# EasyEDA Pro project myfly.eprj

# Schematic Schematic1

## Sheets
1 P1: Board Name: Board1; Create Date: 2025-08-05; Page Name: P1; Project Name: myfly; Schematic Name: Schematic1; Update Date: 2025-09-26; Company: 嘉立创EDA; Page Size: A4; Version: V1.0
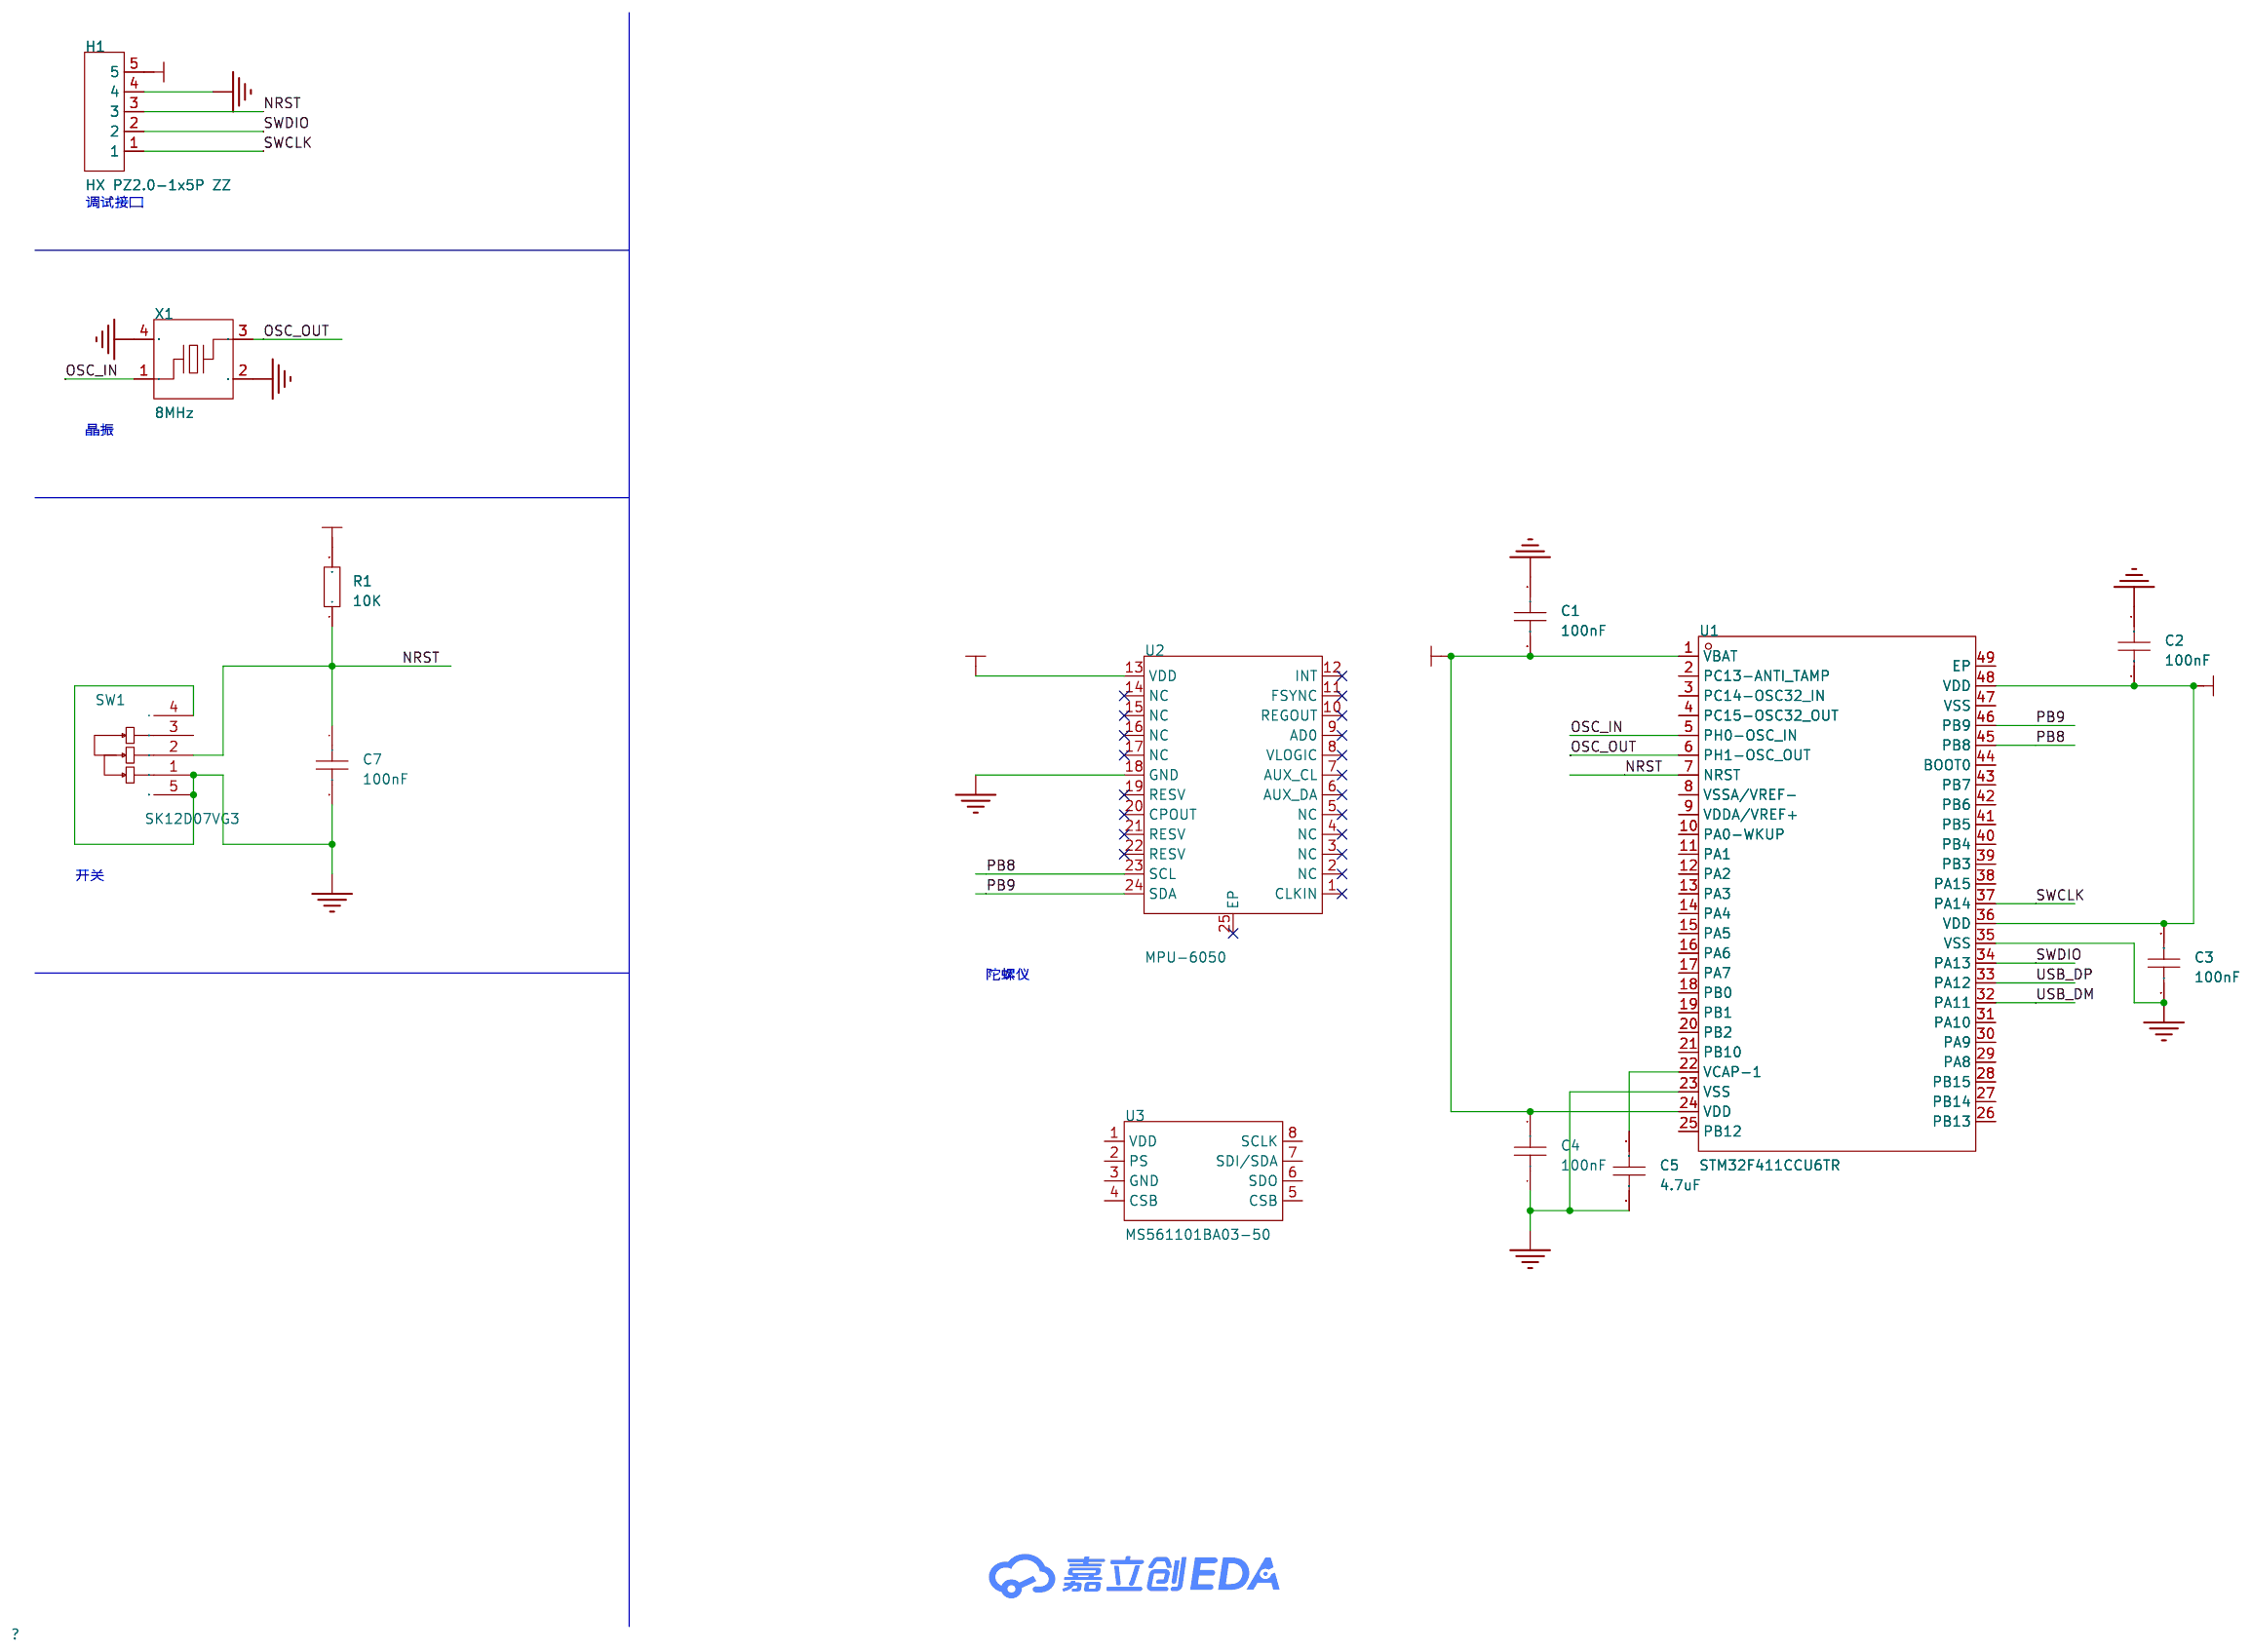
[diagram p0: P1]
2 P2: Create Date: 2025-09-27; Page Name: P2; Update Date: 2025-09-27
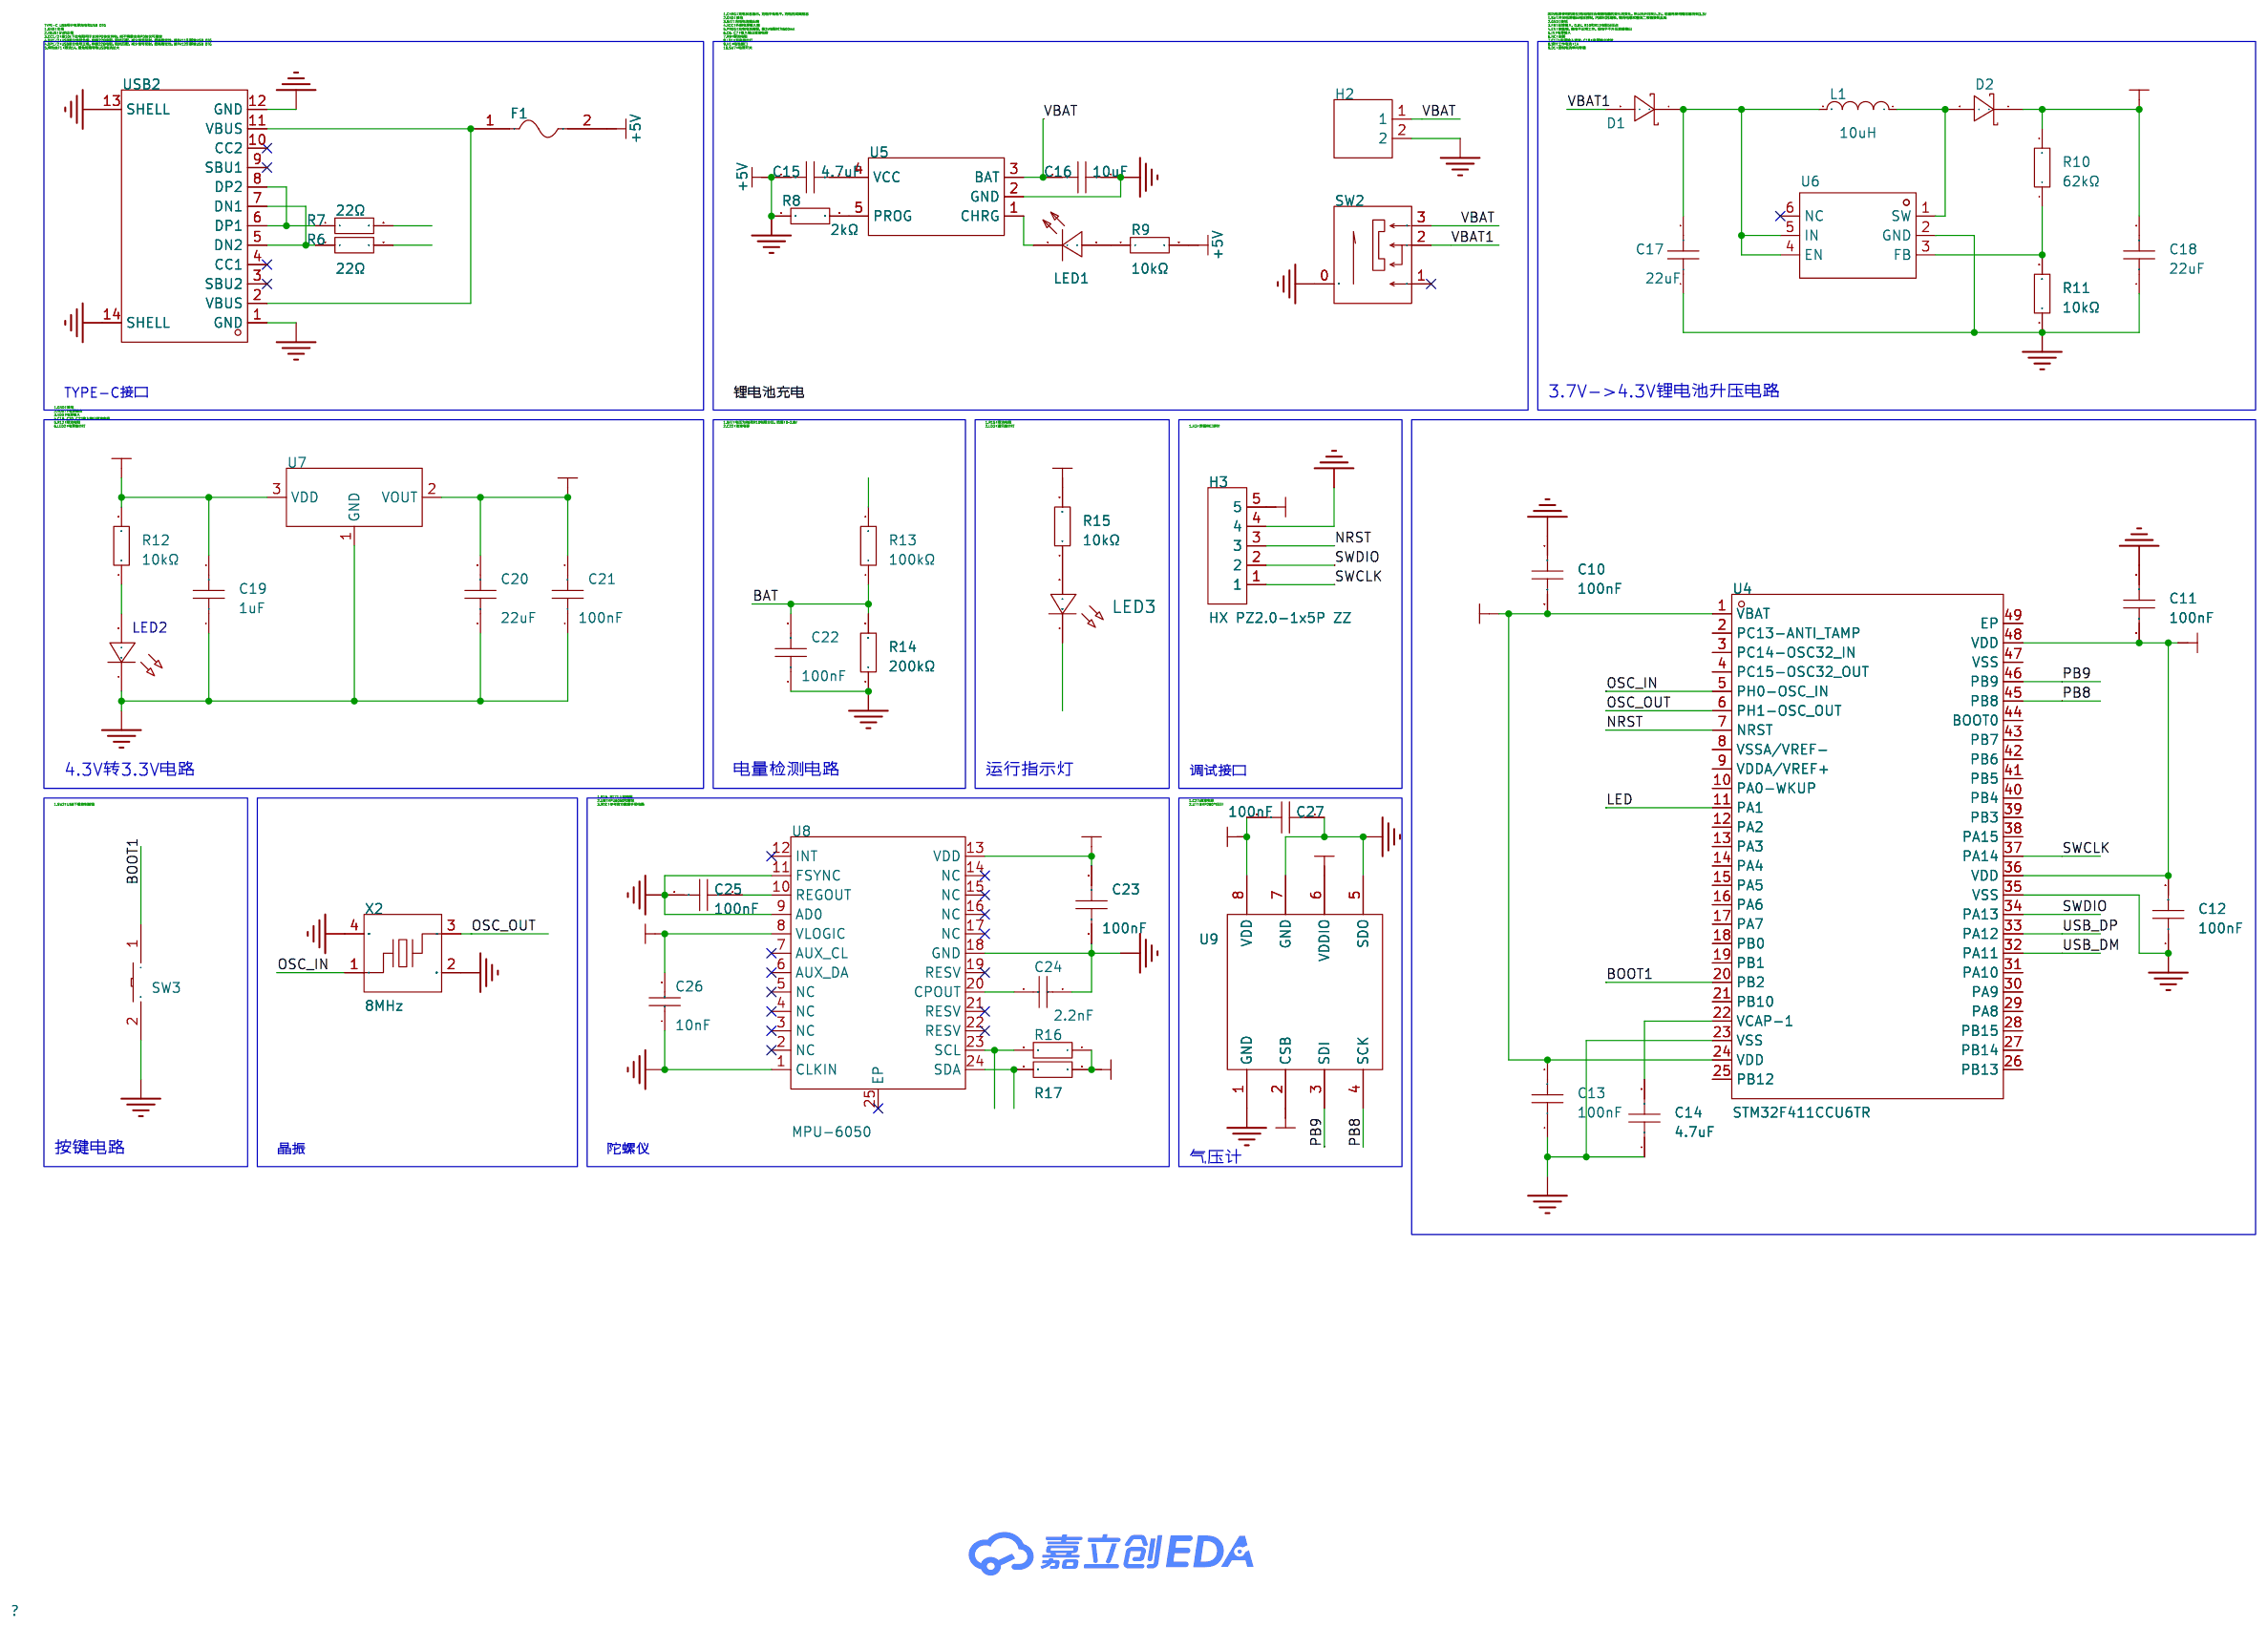
[diagram p1: P2]

## Parts
sheet P1
C1  100nF  [C0402]
C2  100nF  [C0402]
C3  100nF  [C0402]
C4  100nF  [C0402]
C5  4.7uF  [C0402]
C7  100nF  [C0402]
H1  HX PZ2.0-1x5P ZZ  [HDR-TH_5P-P2.00-V-M]
R1  10K  [R0402]
SW1  SK12D07VG3  [SW-TH_SK12D07VG3]
U1  STM32F411CCU6TR  [QFN-48_L7.0-W7.0-P0.50-BL-EP5.1]
U2  MPU-6050  [QFN-24_L4.0-W4.0-P0.50-BL-EP2.7]
U3  MS561101BA03-50  [SENSORS-SMD_MS5611-01BA03]
X1  8MHz  [CRYSTAL-SMD_4P-L3.2-W2.5-BL]
sheet P2
C10  100nF  [C0402]
C11  100nF  [C0402]
C12  100nF  [C0402]
C13  100nF  [C0402]
C14  4.7uF  [C0402]
C15  4.7uF  [C0603]
C16  10uF  [C0603]
C17  22uF  [C0805]
C18  22uF  [C0805]
C19  1uF  [C0603]
C20  22uF  [C0603]
C21  100nF  [C0603]
C22  100nF  [C0603]
C23  100nF  [C0603]
C24  2.2nF  [C0603]
C25  100nF  [C0603]
C26  10nF  [C0603]
C27  100nF  [C0603]
D1  1N5819WS  [SOD-323_L1.8-W1.3-LS2.5-RD]
D2  1N5819WS  [SOD-323_L1.8-W1.3-LS2.5-RD]
F1  JK-nSMD100/16V  [F1206]
H2  B-2100S02P-A110  [HDR-TH_2P-P2.54-V-M-1]
H3  HX PZ2.0-1x5P ZZ  [HDR-TH_5P-P2.00-V-M]
L1  10uH  [IND-SMD_L2.5-W2.0]
LED1  KT-0603R  [LED0603-RD]
LED2  -  [LED_0603]
LED3  -  [LED_0603]
R6  22Ω  [R0603]
R7  22Ω  [R0603]
R8  2kΩ  [R0603]
R9  10kΩ  [R0603]
R10  62kΩ  [R0603]
R11  10kΩ  [R0603]
R12  10kΩ  [R0603]
R13  100kΩ  [R0603]
R14  200kΩ  [R0603]
R15  10kΩ  [R0603]
R16  4.7kΩ  [R0603]
R17  4.7kΩ  [R0603]
SW2  SK-3296S-01-L1  [SW-SMD_3P-P1.50_L2.7-W6.6]
SW3  TS-1101-C-W  [SW-SMD_L6.0-W3.3-LS8.0]
U4  STM32F411CCU6TR  [QFN-48_L7.0-W7.0-P0.50-BL-EP5.1]
U5  LTH7  [SOT-23-5_L2.9-W1.6-P0.95-LS2.8-BR]
U6  MT3608  [SOT-23-6_L2.9-W1.6-P0.95-LS2.8-BL]
U7  662K  [SOT-23-3_L2.9-W1.3-P1.90-LS2.4-BR]
U8  MPU-6050  [QFN-24_L4.0-W4.0-P0.50-BL-EP2.7]
U9  BMP280  [LGA-8_L2.5-W2.0-P0.65_AMP6127]
USB2  TYPE-C 16PIN 2MD(073)  [USB-C-SMD_TYPE-C-6PIN-2MD-073]
X2  8MHz  [CRYSTAL-SMD_4P-L3.2-W2.5-BL]

## Library data of the parts
C1-C4 C7 C10-C13 = CGA0402X7R104J250GT: LCSC Part Name: 100nF ±5% 25V; Supplier Part: C22435941; Manufacturer: HRE(芯声); Supplier Footprint: 0402; JLCPCB Part Class: 扩展库; Datasheet: https://atta.szlcsc.com/upload/public/pdf/source/20240523/30A76BBCEDA9B9BDA9820C36AA3915E8.pdf; Supplier: LCSC; Tolerance: ±5%; Voltage Rating: 25V; Temperature Coefficient: X7R
C5 C14 = HGC0402R5475K6R3NTEJ: LCSC Part Name: 4.7uF ±10% 6.3V; Supplier Part: C33595852; Manufacturer: Chinocera(华瓷); Supplier Footprint: 0402; JLCPCB Part Class: 扩展库; Datasheet: https://atta.szlcsc.com/upload/public/pdf/source/20240724/7749F3690BCC21BF5565A9D339ADF00C.pdf; Supplier: LCSC; Tolerance: ±10%; Voltage Rating: 6.3V; Temperature Coefficient: X5R
H1 H3 = HX PZ2.0-1x5P ZZ: LCSC Part Name: 1x5P 间距:2mm 方针 直插; Supplier Part: C22438288; Manufacturer: hanxia(韩下); Supplier Footprint: 插件,P=2mm; JLCPCB Part Class: 扩展库; Datasheet: https://atta.szlcsc.com/upload/public/pdf/source/20240522/F56687081F4A85741F3B635386D52F83.pdf; Supplier: LCSC; Pin Structure: 1x5P; Pitch: 2mm; Circluar Pins/Square Pins: 方针; Mounting Type: 直插; Number of Rows: 单排; Number of Pins: 5P; Current Rating: 1.5A; Length of Mating Pin: 3.9mm; Insulation Height: 2mm; Length of End Connection Pin: 2.8mm; Contact Material: 磷青铜; Contact Plating: 金; Operating Temperature: -40℃~+105℃; Color: 黑色
R1 = Res_0402: Supplier Footprint: 0402
SW1 = SK12D07VG3: LCSC Part Name: 两档位卧式拨动开关,柄长3MM; Supplier Part: C431547; Manufacturer: SHOU HAN(首韩); Supplier Footprint: 插件,8.7x4.4mm; JLCPCB Part Class: 扩展库; Datasheet: https://item.szlcsc.com/datasheet/SK12D07VG3/427904.html; Supplier: LCSC; Circuit: 单刀双掷; Termination Style: PC引脚; Length: 8.7mm; Width: 4.4mm; Switch Height: 4.7mm; Current Rating: 500mA; Voltage Rating: 50V; Life: 5千次; Operating Temperature: -10℃~+50℃
U1 U4 = STM32F411CCU6TR: LCSC Part Name: 带DSP和FPU的高性能基本型系列ARM Cortex-M4 MCU，具有256 KB Flash、100 MHz CPU和ART加速器; Supplier Part: C190642; Manufacturer: ST(意法半导体); Supplier Footprint: UFQFPN-48(7x7); JLCPCB Part Class: 扩展库; Datasheet: https://atta.szlcsc.com/upload/public/pdf/source/20190409/C382005_8CBD24B6066A9CB66A02776CA579708B.pdf; Supplier: LCSC; CPU Core: ARM-M4; CPU Maximum Speed: 100MHz; Program Storage Size: 256KB; Program Memory Type: FLASH; Number of I/O: 36; ADC (Bit): 12bit; Voltage - Supply: 1.7V~3.6V
U2 U8 = MPU-6050: Supplier Part: C24112; Manufacturer: TDK InvenSense(应美盛); Supplier Footprint: QFN-24-EP(4x4); JLCPCB Part Class: 扩展库; Datasheet: https://item.szlcsc.com/datasheet/MPU-6050/24852.html; Supplier: LCSC; Sensor Type: 加速度计陀螺仪; Operating Temperature: -40℃~+85℃
U3 = MS561101BA03-50: Supplier Part: C15639; Manufacturer: TE Connectivity(泰科电子); Supplier Footprint: QFN-8(3x5); JLCPCB Part Class: 扩展库; Datasheet: https://item.szlcsc.com/datasheet/MS561101BA03-50/16320.html; Supplier: LCSC; Pressure range: 1Kpa~1.2bar; Voltage - Supply: 1.8V~3.6V; Standby Current: 140nA; Interface: SpI；I2C; Operating Temperature: -40℃~+85℃; Response time: 8.22ms
X1 X2 = SX3B8.000F2010F30: LCSC Part Name: 8MHz ±10ppm 20pF; Supplier Part: C2901646; Manufacturer: SCTF(星通时频); Supplier Footprint: SMD3225-4P; JLCPCB Part Class: 扩展库; Datasheet: https://item.szlcsc.com/datasheet/SX3B8.000F2010F30/3151459.html; Supplier: LCSC; Type: 贴片晶振; Normal temperature Frequency Tolerance: ±10ppm; Load Capacitance: 20pF; Frequency Stability: ±30ppm; Equivalent Series Resistance(ESR): 300Ω; Operating Temperature: -40℃~+85℃
C15 = CL10A475KO8NNNC: LCSC Part Name: 4.7uF ±10% 16V; Supplier Part: C19666; Manufacturer: SAMSUNG(三星); Supplier Footprint: 0603; JLCPCB Part Class: 基础库; Datasheet: https://item.szlcsc.com/datasheet/CL10A475KO8NNNC/20375.html; Supplier: LCSC; Tolerance: ±10%; Voltage Rating: 16V; Temperature Coefficient: X5R
C16 = CL10A106KP8NNNC: LCSC Part Name: 10uF ±10% 10V; Supplier Part: C19702; Manufacturer: SAMSUNG(三星); Supplier Footprint: 0603; JLCPCB Part Class: 基础库; Datasheet: https://item.szlcsc.com/datasheet/CL10A106KP8NNNC/20411.html; Supplier: LCSC; Tolerance: ±10%; Voltage Rating: 10V; Temperature Coefficient: X5R
C17 C18 = CL21A226MAQNNNE: LCSC Part Name: 22uF ±20% 25V; Supplier Part: C45783; Manufacturer: SAMSUNG(三星); Supplier Footprint: 0805; JLCPCB Part Class: 基础库; Datasheet: https://item.szlcsc.com/datasheet/CL21A226MAQNNNE/46786.html; Supplier: LCSC; Tolerance: ±20%; Voltage Rating: 25V; Temperature Coefficient: X5R
C19 = CL10A105KB8NNNC: LCSC Part Name: 1uF ±10% 50V; Supplier Part: C15849; Manufacturer: SAMSUNG(三星); Supplier Footprint: 0603; JLCPCB Part Class: 基础库; Datasheet: https://item.szlcsc.com/datasheet/CL10A105KB8NNNC/16531.html; Supplier: LCSC; Tolerance: ±10%; Voltage Rating: 50V; Temperature Coefficient: X5R
C20 = CL10A226MQ8NRNC: LCSC Part Name: 22uF ±20% 6.3V; Supplier Part: C59461; Manufacturer: SAMSUNG(三星); Supplier Footprint: 0603; JLCPCB Part Class: 基础库; Datasheet: https://item.szlcsc.com/datasheet/CL10A226MQ8NRNC/60514.html; Supplier: LCSC; Tolerance: ±20%; Voltage Rating: 6.3V; Temperature Coefficient: X5R
C21-C23 C25 C27 = CL10B104KB8NNNC: LCSC Part Name: 100nF ±10% 50V; Supplier Part: C1591; Manufacturer: SAMSUNG(三星); Supplier Footprint: 0603; JLCPCB Part Class: 扩展库; Datasheet: https://item.szlcsc.com/datasheet/CL10B104KB8NNNC/1943.html; Supplier: LCSC; Tolerance: ±10%; Voltage Rating: 50V; Temperature Coefficient: X7R
C24 = CL10B222KB8NNNC: LCSC Part Name: 2.2nF ±10% 50V; Supplier Part: C16033; Manufacturer: SAMSUNG(三星); Supplier Footprint: 0603; JLCPCB Part Class: 扩展库; Datasheet: https://item.szlcsc.com/datasheet/CL10B222KB8NNNC/16715.html; Supplier: LCSC; Tolerance: ±10%; Voltage Rating: 50V; Temperature Coefficient: X7R
C26 = CL10B103KB8NNNC: LCSC Part Name: 10nF ±10% 50V; Supplier Part: C1589; Manufacturer: SAMSUNG(三星); Supplier Footprint: 0603; JLCPCB Part Class: 扩展库; Datasheet: https://item.szlcsc.com/datasheet/CL10B103KB8NNNC/1941.html; Supplier: LCSC; Tolerance: ±10%; Voltage Rating: 50V; Temperature Coefficient: X7R
D1 D2 = 1N5819WS_C191023: LCSC Part Name: 电压:40V 电流:1A; Supplier Part: C191023; Manufacturer: Hottech(合科泰); Supplier Footprint: SOD-323; JLCPCB Part Class: 基础库; Datasheet: https://item.szlcsc.com/datasheet/1N5819WS/213850.html; Supplier: LCSC; Voltage - Forward(Vf@If): 600mV@1A; Voltage - DC Reverse(Vr): 40V; Current - Rectified: 1A; Non-Repetitive Peak Forward Surge Current: 25A
F1 = JK-nSMD100/16V: LCSC Part Name: 16V 1A 1206自恢复; Supplier Part: C2830246; Manufacturer: JK(金科); Supplier Footprint: 1206; JLCPCB Part Class: 扩展库; Datasheet: https://atta.szlcsc.com/upload/public/pdf/source/20190807/C409806_27B0F7EFFA3D5CEE60CCD1EE0A933E0A.pdf; Supplier: LCSC; Voltage - Max: 16V; Current - Max: 100A; Hold Current: 1A; Trip Current: 1.8A; Resistance - Initial (Ri) (Min): 55mΩ; Resistance - Post Trip (R1) (Max): 330mΩ; Time to Trip(Max): 300ms; Operating Temperature: -40℃~+85℃
H2 = B-2100S02P-A110: LCSC Part Name: 1x2P 间距:2.54mm 直插; Supplier Part: C124375; Manufacturer: Ckmtw(灿科盟); Supplier Footprint: 插件,P=2.54mm; JLCPCB Part Class: 扩展库; Datasheet: https://item.szlcsc.com/datasheet/B-2100S02P-A110/125650.html; Supplier: LCSC; Pin Structure: 1x2P; Pitch: 2.54mm; Mounting Type: 直插; Number of Rows: 单排; Number of Pins: 2P; Length of Mating Pin: 6mm; Insulation Height: 2.54mm; Length of End Connection Pin: 3mm; Contact Material: 黄铜; Operating Temperature: -40℃~+105℃; Color: 黑色
L1 = FTC252012S100MBCA: LCSC Part Name: 10uH ±20% 1.6A; Supplier Part: C5832376; Manufacturer: cjiang(长江微电); Supplier Footprint: SMD,2x2.5mm; JLCPCB Part Class: 扩展库; Datasheet: https://atta.szlcsc.com/upload/public/pdf/source/20230602/8FFEDA9C0247A92A0D4B67554BFE4091.pdf; Supplier: LCSC; Tolerance: ±20%; Rated Current: 1.2A; Saturation Current (Isat): 1.6A; DC Resistance (DCR): 330mΩ; Type: 一体成型电感
LED1 = KT-0603R: LCSC Part Name: 0603 红灯 高亮; Supplier Part: C2286; Manufacturer: KENTO; Supplier Footprint: 0603; JLCPCB Part Class: 基础库; Datasheet: https://atta.szlcsc.com/upload/public/pdf/source/20160616/1466072038404.pdf; Supplier: LCSC; Emitted Color: 红色; Operating Temperature: -40℃~+85℃
LED2 = LED_0603-G: Supplier Footprint: 0603
LED3 = LED_0603-R: Supplier Footprint: 0603
R6 R7 = 0603WAF220JT5E: LCSC Part Name: 22Ω ±1% 100mW 厚膜电阻; Supplier Part: C23345; Manufacturer: UNI-ROYAL(厚声); Supplier Footprint: 0603; JLCPCB Part Class: 基础库; Datasheet: https://atta.szlcsc.com/upload/public/pdf/source/20200306/C422600_1E6D84923E4A46A82E41ADD87F860B5C.pdf; Supplier: LCSC; Type: 厚膜电阻; Tolerance: ±1%; Power(Watts): 100mW; Overload Voltage (Max): 75V; Temperature Coefficient: ±100ppm/℃; Operating Temperature Range: -55℃~+155℃
R8 = 0603WAF2001T5E: LCSC Part Name: 2kΩ ±1% 100mW 厚膜电阻; Supplier Part: C22975; Manufacturer: UNI-ROYAL(厚声); Supplier Footprint: 0603; JLCPCB Part Class: 基础库; Datasheet: https://item.szlcsc.com/datasheet/0603WAF2001T5E/23702.html; Supplier: LCSC; Type: 厚膜电阻; Tolerance: ±1%; Power(Watts): 100mW; Voltage-Supply(Max): 75V; Temperature Coefficient: ±100ppm/℃; Operating Temperature: -55℃~+155℃
R9 R11 R12 R15 = 0603WAF1002T5E: LCSC Part Name: 厚膜电阻 10kΩ ±1% 100mW; Supplier Part: C25804; Manufacturer: UNI-ROYAL(厚声); Supplier Footprint: 0603; JLCPCB Part Class: 基础库; Datasheet: https://item.szlcsc.com/datasheet/0603WAF1002T5E/26547.html; Supplier: LCSC; Type: 厚膜电阻; Tolerance: ±1%; Power(Watts): 100mW; Voltage-Supply(Max): 75V; Temperature Coefficient: ±100ppm/℃; Operating Temperature: -55℃~+155℃
R10 = 0603WAF6202T5E: LCSC Part Name: 62kΩ ±1% 100mW 厚膜电阻; Supplier Part: C23221; Manufacturer: UNI-ROYAL(厚声); Supplier Footprint: 0603; JLCPCB Part Class: 扩展库; Datasheet: https://item.szlcsc.com/datasheet/0603WAF6202T5E/23948.html; Supplier: LCSC; Type: 厚膜电阻; Tolerance: ±1%; Power(Watts): 100mW; Voltage-Supply(Max): 75V; Temperature Coefficient: ±100ppm/℃; Operating Temperature: -55℃~+155℃
R13 = 0603WAF1003T5E: LCSC Part Name: 100kΩ ±1% 100mW 厚膜电阻; Supplier Part: C25803; Manufacturer: UNI-ROYAL(厚声); Supplier Footprint: 0603; JLCPCB Part Class: 基础库; Datasheet: https://item.szlcsc.com/datasheet/0603WAF1003T5E/26546.html; Supplier: LCSC; Type: 厚膜电阻; Tolerance: ±1%; Power(Watts): 100mW; Voltage-Supply(Max): 75V; Temperature Coefficient: ±100ppm/℃; Operating Temperature: -55℃~+155℃
R14 = 0603WAF2003T5E: LCSC Part Name: 200kΩ ±1% 100mW 厚膜电阻; Supplier Part: C25811; Manufacturer: UNI-ROYAL(厚声); Supplier Footprint: 0603; JLCPCB Part Class: 基础库; Datasheet: https://atta.szlcsc.com/upload/public/pdf/source/20200306/C422600_1E6D84923E4A46A82E41ADD87F860B5C.pdf; Supplier: LCSC; Type: 厚膜电阻; Tolerance: ±1%; Power(Watts): 100mW; Overload Voltage (Max): 75V; Temperature Coefficient: ±100ppm/℃; Operating Temperature Range: -55℃~+155℃
R16 R17 = 0603WAF4701T5E: LCSC Part Name: 4.7kΩ ±1% 100mW 厚膜电阻; Supplier Part: C23162; Manufacturer: UNI-ROYAL(厚声); Supplier Footprint: 0603; JLCPCB Part Class: 基础库; Datasheet: https://item.szlcsc.com/datasheet/0603WAF4701T5E/23889.html; Supplier: LCSC; Type: 厚膜电阻; Tolerance: ±1%; Power(Watts): 100mW; Voltage-Supply(Max): 75V; Temperature Coefficient: ±100ppm/℃; Operating Temperature: -55℃~+155℃
SW2 = SK-3296S-01-L1: LCSC Part Name: 柄长1.5mm 卧贴双档 滑动开关; Supplier Part: C319020; Manufacturer: XKB Connection(中国星坤); Supplier Footprint: SMD,7.8x2.8mm; JLCPCB Part Class: 扩展库; Datasheet: https://item.szlcsc.com/datasheet/SK-3296S-01-L1/300112.html; Supplier: LCSC; Circuit: 单刀双掷; Actuator Style: 矩形柱状; Termination Style: SMD接片; Length: 7.8mm; Width: 2.75mm; Switch Height: 1.35mm; Mounting Type: 卧贴; Actuator Color: 黑色; Current Rating: 50mA; Voltage Rating: 12V; Life: 1万次; Operating Temperature: -40℃~+85℃
SW3 = TS-1101-C-W: LCSC Part Name: 6*3.6*2.5mm 立贴 轻触开关; Supplier Part: C318938; Manufacturer: XKB Connectivity(中国星坤); Supplier Footprint: SMD; JLCPCB Part Class: 扩展库; Datasheet: https://atta.szlcsc.com/upload/public/pdf/source/20200227/C318938_C2E53B1EEDE37D980A33616AC086DE53.pdf; Supplier: LCSC; Circuit: 单刀单掷; Actuator Style: 矩形按钮; Operating Force: 260gf; Mounting Style: 立贴; Switch Length: 6mm; Switch Width: 3.6mm; Switch Height: 2.5mm; Strike Gundam: 不带; Contact Current: 50mA; Voltage Rating (DC): 12V; Actuator/Cap Color: 白色带淡绿; With Lamp: 无; Mechanical Life: 5万次; Operating Temperature: -30℃~+85℃
U5 = LTH7_C5342381: LCSC Part Name: 微型线性电池管理芯片; Supplier Part: C5342381; Manufacturer: TECH PUBLIC(台舟); Supplier Footprint: SOT-23-5L; JLCPCB Part Class: 扩展库; Datasheet: https://item.szlcsc.com/datasheet/LTH7/6117948.html; Supplier: LCSC
U6 = MT3608: LCSC Part Name: 老版本 高效1.2MHz 2A升压转换器; Supplier Part: C84817; Manufacturer: 西安航天民芯; Supplier Footprint: SOT-23-6; JLCPCB Part Class: 扩展库; Datasheet: https://item.szlcsc.com/datasheet/MT3608/85988.html; Supplier: LCSC; Function: 升压型; Output Type: 可调; Voltage - Supply: 2V~24V; Output Current: 2A; Frequency - Switching: 1.2MHz; Operating Temperature: -40℃~+85℃; Synchronous Rectifier: 否; Number of Outputs: 1; Topology: 升压式; Quiescent Current: 100uA；1.6mA; Switch tube (built-in/external): 内置
U7 = 662K: LCSC Part Name: 662K. 输入8V 300mA; Supplier Part: C7470756; Manufacturer: HXY MOSFET(华轩阳电子); Supplier Footprint: SOT-23; JLCPCB Part Class: 扩展库; Datasheet: https://item.szlcsc.com/datasheet/662K/8523266.html; Supplier: LCSC; Output Type: 固定; Voltage - Supply: 8V; Output Voltage: 3.3V; Output Current: 300mA; Power Supply Rejection Ratio (PSRR): 40dB@(1kHz); Voltage Dropout: 160mV@(50mA); standby current: 3uA; Features: 过流保护; Operating Temperature: -40℃~+85℃; Output Configuration: 正极; Number of Outputs: 1
U9 = BMP280: LCSC Part Name: BMP280 停产; Supplier Part: C83291; Manufacturer: Bosch(博世); Supplier Footprint: LGA-8(2x2.5); JLCPCB Part Class: 扩展库; Datasheet: https://atta.szlcsc.com/upload/public/pdf/source/20200702/C83291_F39E84AB7DFC569A4C7554F8659640A1.pdf; Supplier: LCSC
USB2 = TYPE-C 16PIN 2MD(073): LCSC Part Name: Type-C 母 卧贴; Supplier Part: C2765186; Manufacturer: SHOU HAN(首韩); Supplier Footprint: SMD; JLCPCB Part Class: 扩展库; Datasheet: https://item.szlcsc.com/datasheet/TYPE-C%252016PIN%25202MD(073)/2901843.html; Supplier: LCSC; Connector Type: Type-C; Gender: 母; Mounting Type: 卧贴; Number of Contacts: 16P; Number of Ports: 1; Current Rating-Power: 3A; Voltage Rating: 5V; Connect-Disconnect Life: 5千次; Detection color: 黑色; Operating Temperature: -25℃~+85℃

## Nets
3V3_1: C1.2 C2.2 C3.2 C4.2 H1.5 R1.2 U1.1(VBAT) U1.24(VDD) U1.36(VDD) U1.48(VDD) U2.13(VDD)
+3.3V: C10.2 C11.2 C12.2 C13.2 C20.2 C21.2 C23.1 C23.2 C24.2 C26.2 C27.2 H3.5 R15.2 R16.1 R17.1 U4.1(VBAT) U4.24(VDD) U4.36(VDD) U4.48(VDD) U7.2(VOUT) U8.8(VLOGIC) U8.13(VDD) U8.18(GND) U9.2(CSB) U9.6(VDDIO) U9.8(VDD)
+4.3V: C18.2 C19.2 D2.1(K) R10.2 R12.2 U7.3(VDD)
+5V: C15.1 F1.2 R8.1 R9.2
GND: C1.1 C2.1 C3.1 C4.1 C5.1 C7.2 C10.1 C11.1 C12.1 C13.1 C14.1 C16.2 C17.1 C18.1 C19.1 C20.1 C21.1 C22.1 C25.2 C26.1 C27.1 H1.4 H2.2 H3.4 LED2.1(C) R11.1 R14.1 SW1.1 SW1.4 SW1.5 SW2.0 SW3.2 U1.23(VSS) U1.35(VSS) U2.18(GND) U4.23(VSS) U4.35(VSS) U5.2(GND) U6.2(GND) U7.1(GND) U8.1(CLKIN) U8.9(AD0) U8.11(FSYNC) U9.1(GND) U9.5(SDO) U9.7(GND) USB2.1(GND) USB2.12(GND) USB2.13(SHELL) USB2.14(SHELL) X1.2(GND) X1.4(GND) X2.2(GND) X2.4(GND)
VBAT: C16.1 H2.1 SW2.3 U5.3(BAT)
VBAT1: D1.2(A) SW2.2
BAT: C22.2 R13.1 R14.2
BOOT1: SW3.1 U4.20(PB2)
LED: U4.11(PA1)
NRST: C7.1 H1.3 H3.3 R1.1 SW1.2 U1.7(NRST) U4.7(NRST)
OSC_IN: U1.5(PH0-OSC_IN) U4.5(PH0-OSC_IN) X1.1 X2.1
OSC_OUT: U1.6(PH1-OSC_OUT) U4.6(PH1-OSC_OUT) X1.3 X2.3
PB8: U1.45(PB8) U2.23(SCL) U4.45(PB8) U9.4(SCK)
PB9: U1.46(PB9) U2.24(SDA) U4.46(PB9) U9.3(SDI)
SWCLK: H1.1 H3.1 U1.37(PA14) U4.37(PA14)
SWDIO: H1.2 H3.2 U1.34(PA13) U4.34(PA13)
USB_DM: U1.32(PA11) U4.32(PA11)
USB_DP: U1.33(PA12) U4.33(PA12)
Net-(C5-2): C5.2 U1.22(VCAP-1)
Net-(C14-2): C14.2 U4.22(VCAP-1)
Net-(C15-2): C15.2 U5.4(VCC)
Net-(C17-2): C17.2 D1.1(K) L1.2 U6.4(EN) U6.5(IN)
Net-(C24-1): C24.1 U8.20(CPOUT)
Net-(C25-1): C25.1 U8.10(REGOUT)
Net-(D2-2): D2.2(A) L1.1 U6.1(SW)
Net-(F1-1): F1.1 USB2.2(VBUS) USB2.11(VBUS)
Net-(LED1-1): LED1.1(K) U5.1(CHRG)
Net-(LED1-2): LED1.2(A) R9.1
Net-(LED2-2): LED2.2(A) R12.1
Net-(LED3-2): LED3.2(A) R15.1
Net-(R6-1): R6.1 USB2.5(DN2) USB2.7(DN1)
Net-(R7-1): R7.1 USB2.6(DP1) USB2.8(DP2)
Net-(R8-2): R8.2 U5.5(PROG)
Net-(R10-1): R10.1 R11.2 U6.3(FB)
Net-(R16-2): R16.2 U8.23(SCL)
Net-(R17-2): R17.2 U8.24(SDA)

Not connected (* = marked no-connect by the designer): LED3 1(C); R6 2; R7 2; R13 2; SW1 3; SW2 1*; U1 2(PC13-ANTI_TAMP) 3(PC14-OSC32_IN) 4(PC15-OSC32_OUT) 8(VSSA/VREF-) 9(VDDA/VREF+) 10(PA0-WKUP) 11(PA1) 12(PA2) 13(PA3) 14(PA4) 15(PA5) 16(PA6) 17(PA7) 18(PB0) 19(PB1) 20(PB2) 21(PB10) 25(PB12) 26(PB13) 27(PB14) 28(PB15) 29(PA8) 30(PA9) 31(PA10) 38(PA15) 39(PB3) 40(PB4) 41(PB5) 42(PB6) 43(PB7) 44(BOOT0) 47(VSS) 49(EP); U2 1(CLKIN)* 2(NC)* 3(NC)* 4(NC)* 5(NC)* 6(AUX_DA)* 7(AUX_CL)* 8(VLOGIC)* 9(AD0)* 10(REGOUT)* 11(FSYNC)* 12(INT)* 14(NC)* 15(NC)* 16(NC)* 17(NC)* 19(RESV)* 20(CPOUT)* 21(RESV)* 22(RESV)* 25(EP)*; U3 1(VDD) 2(PS) 3(GND) 4(CSB) 5(CSB) 6(SDO) 7(SDI/SDA) 8(SCLK); U4 2(PC13-ANTI_TAMP) 3(PC14-OSC32_IN) 4(PC15-OSC32_OUT) 8(VSSA/VREF-) 9(VDDA/VREF+) 10(PA0-WKUP) 12(PA2) 13(PA3) 14(PA4) 15(PA5) 16(PA6) 17(PA7) 18(PB0) 19(PB1) 21(PB10) 25(PB12) 26(PB13) 27(PB14) 28(PB15) 29(PA8) 30(PA9) 31(PA10) 38(PA15) 39(PB3) 40(PB4) 41(PB5) 42(PB6) 43(PB7) 44(BOOT0) 47(VSS) 49(EP); U6 6(NC)*; U8 2(NC)* 3(NC)* 4(NC)* 5(NC)* 6(AUX_DA)* 7(AUX_CL)* 12(INT)* 14(NC)* 15(NC)* 16(NC)* 17(NC)* 19(RESV)* 21(RESV)* 22(RESV)* 25(EP)*; USB2 3(SBU2)* 4(CC1)* 9(SBU1)* 10(CC2)*

## Notes on the sheets
sheet 1
- 调试接口
- 晶振
- 开关
- 陀螺仪
sheet 2
- TYPE-C USB用于电源充电和USB OTG
  1.GND：负极
  2.VBUS：5V的正极
  3.CC1/2：接10k下拉电阻用于支持PD协议供电，如不需要支持PD协议可悬空
  4.DN1/2：USB差分信号负极，串接22Ω电阻，阻抗匹配，减少信号反射，提高稳定性，接PA11引脚做USB OTG
  4.DP1/2：USB差分信号正极，串接22Ω电阻，阻抗匹配，减少信号反射，提高稳定性，接PA12引脚做USB OTG
  5.保险丝F1：限流1A，避免短路导致USB电流过大
- 1.CHRG：充电状态指示，充电中低电平，充电完成高阻态
  2.GND：接地
  3.BAT：充电电流输出端
  4.VCC：外部电源输入端
  5.PROG：充电电流编程，接2k电阻时为500mA
  6.C6、C7：输入输出滤波电容
  7.R9：限流电阻
  8.LD1：充电指示灯
  9.H1：电池接口
  10.SW7：电源开关
- 因为电源使用的是S1电池电压会根据电量的变化而变化，所以先升压到4.3V，后面再使用稳压器将到3.3V
  1.SW：开关电源输出电压控制，内部MOS漏极，需将电感和整流二极管接到此处
  2.GND：接地
  3.FB：反馈输入，0.6V，R10和R11电阻分压点
  4.EN：使能端，高电平正常工作，低电平不升压直接输出
  5.IN：电源输入
  6.NC：空脚
  7.C17：电源输入滤波，C18：电源输出滤波
  8.设计工作电流：1A
  9.D1：控制电流单向导通
- TYPE-C接口
- 锂电池充电
- 3.7V->4.3V锂电池升压电路
- 1.GND：接地
  2.VOUT：电源输出
  3.VDD：电源输入
  4.C19、C20、C21输入输出滤波电容
  5.R12：限流电阻
  6.LED2：电源指示灯
- 1.BAT：电压为R6和R10电阻分压，范围：0~2.8V
  2.C22：滤波电容
- 1.R15：限流电阻
  2.LD3：通讯指示灯
- 1.H3：预留串口排针
- 4.3V转3.3V电路
- 电量检测电路
- 运行指示灯
- 调试接口
- 1.SW2：USB下载控制按钮
- 1.R16、R17：上拉电阻
  2.U8：MPU6050陀螺仪
  3.其它：参考官方数据手册电路
- 1.C27:滤波电容
  2.U7：BMP280气压计
- 按键电路
- 晶振
- 陀螺仪
- 气压计
